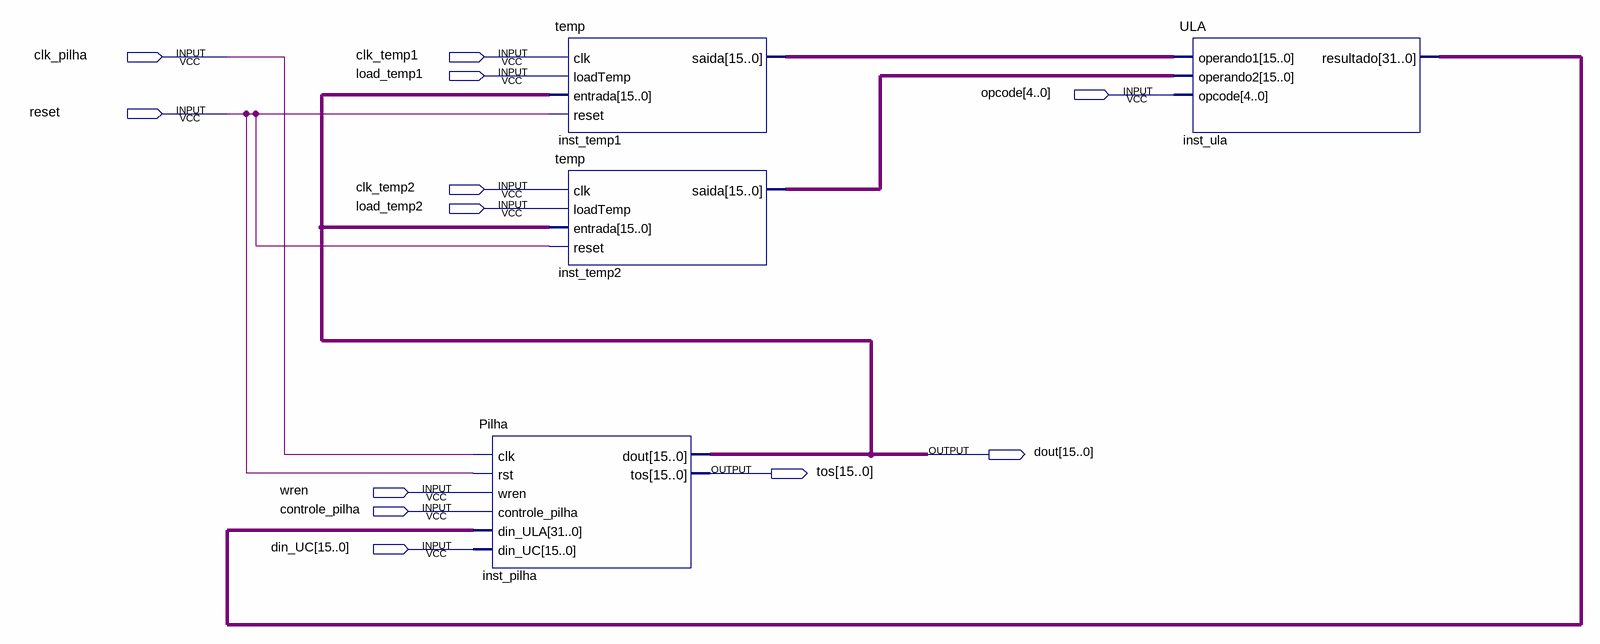
[diagram p0: schematic sheet]
// Quartus schematic datapath.bdf as structural Verilog: 4 symbols, 12 pins
module datapath (
  input  clk_pilha,
  input  clk_temp1,
  input  load_temp1,
  input  [4:0] opcode,
  input  reset,
  input  clk_temp2,
  input  load_temp2,
  input  wren,
  input  controle_pilha,
  input  [15:0] din_UC,
  output [15:0] dout,
  output [15:0] tos
);

  wire [15:0] inst_temp1_saida, inst_temp2_saida;
  wire [31:0] inst_ula_resultado;

  Pilha inst_pilha (
    .clk(clk_pilha), .rst(reset), .wren(wren), .controle_pilha(controle_pilha), .din_ULA(inst_ula_resultado),
    .din_UC(din_UC), .dout(dout), .tos(tos));
  temp inst_temp1 (.clk(clk_temp1), .loadTemp(load_temp1), .entrada(dout), .reset(reset), .saida(inst_temp1_saida));
  temp inst_temp2 (.clk(clk_temp2), .loadTemp(load_temp2), .entrada(dout), .reset(reset), .saida(inst_temp2_saida));
  ULA inst_ula (
    .operando1(inst_temp1_saida), .operando2(inst_temp2_saida), .opcode(opcode),
    .resultado(inst_ula_resultado));
endmodule
